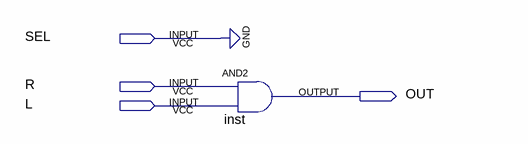
[diagram p0: schematic sheet]
// Quartus schematic Sel.bdf as structural Verilog: 1 symbols, 4 pins
module Sel (
  input  SEL,
  input  R,
  input  L,
  output OUT
);

  and inst (OUT, R, L);
  // also tied to GND on the sheet: SEL
endmodule
